# Altium schematic sheet 22_Hub.SchDoc
size A3; SheetNumber: 4; SheetTotal: 10
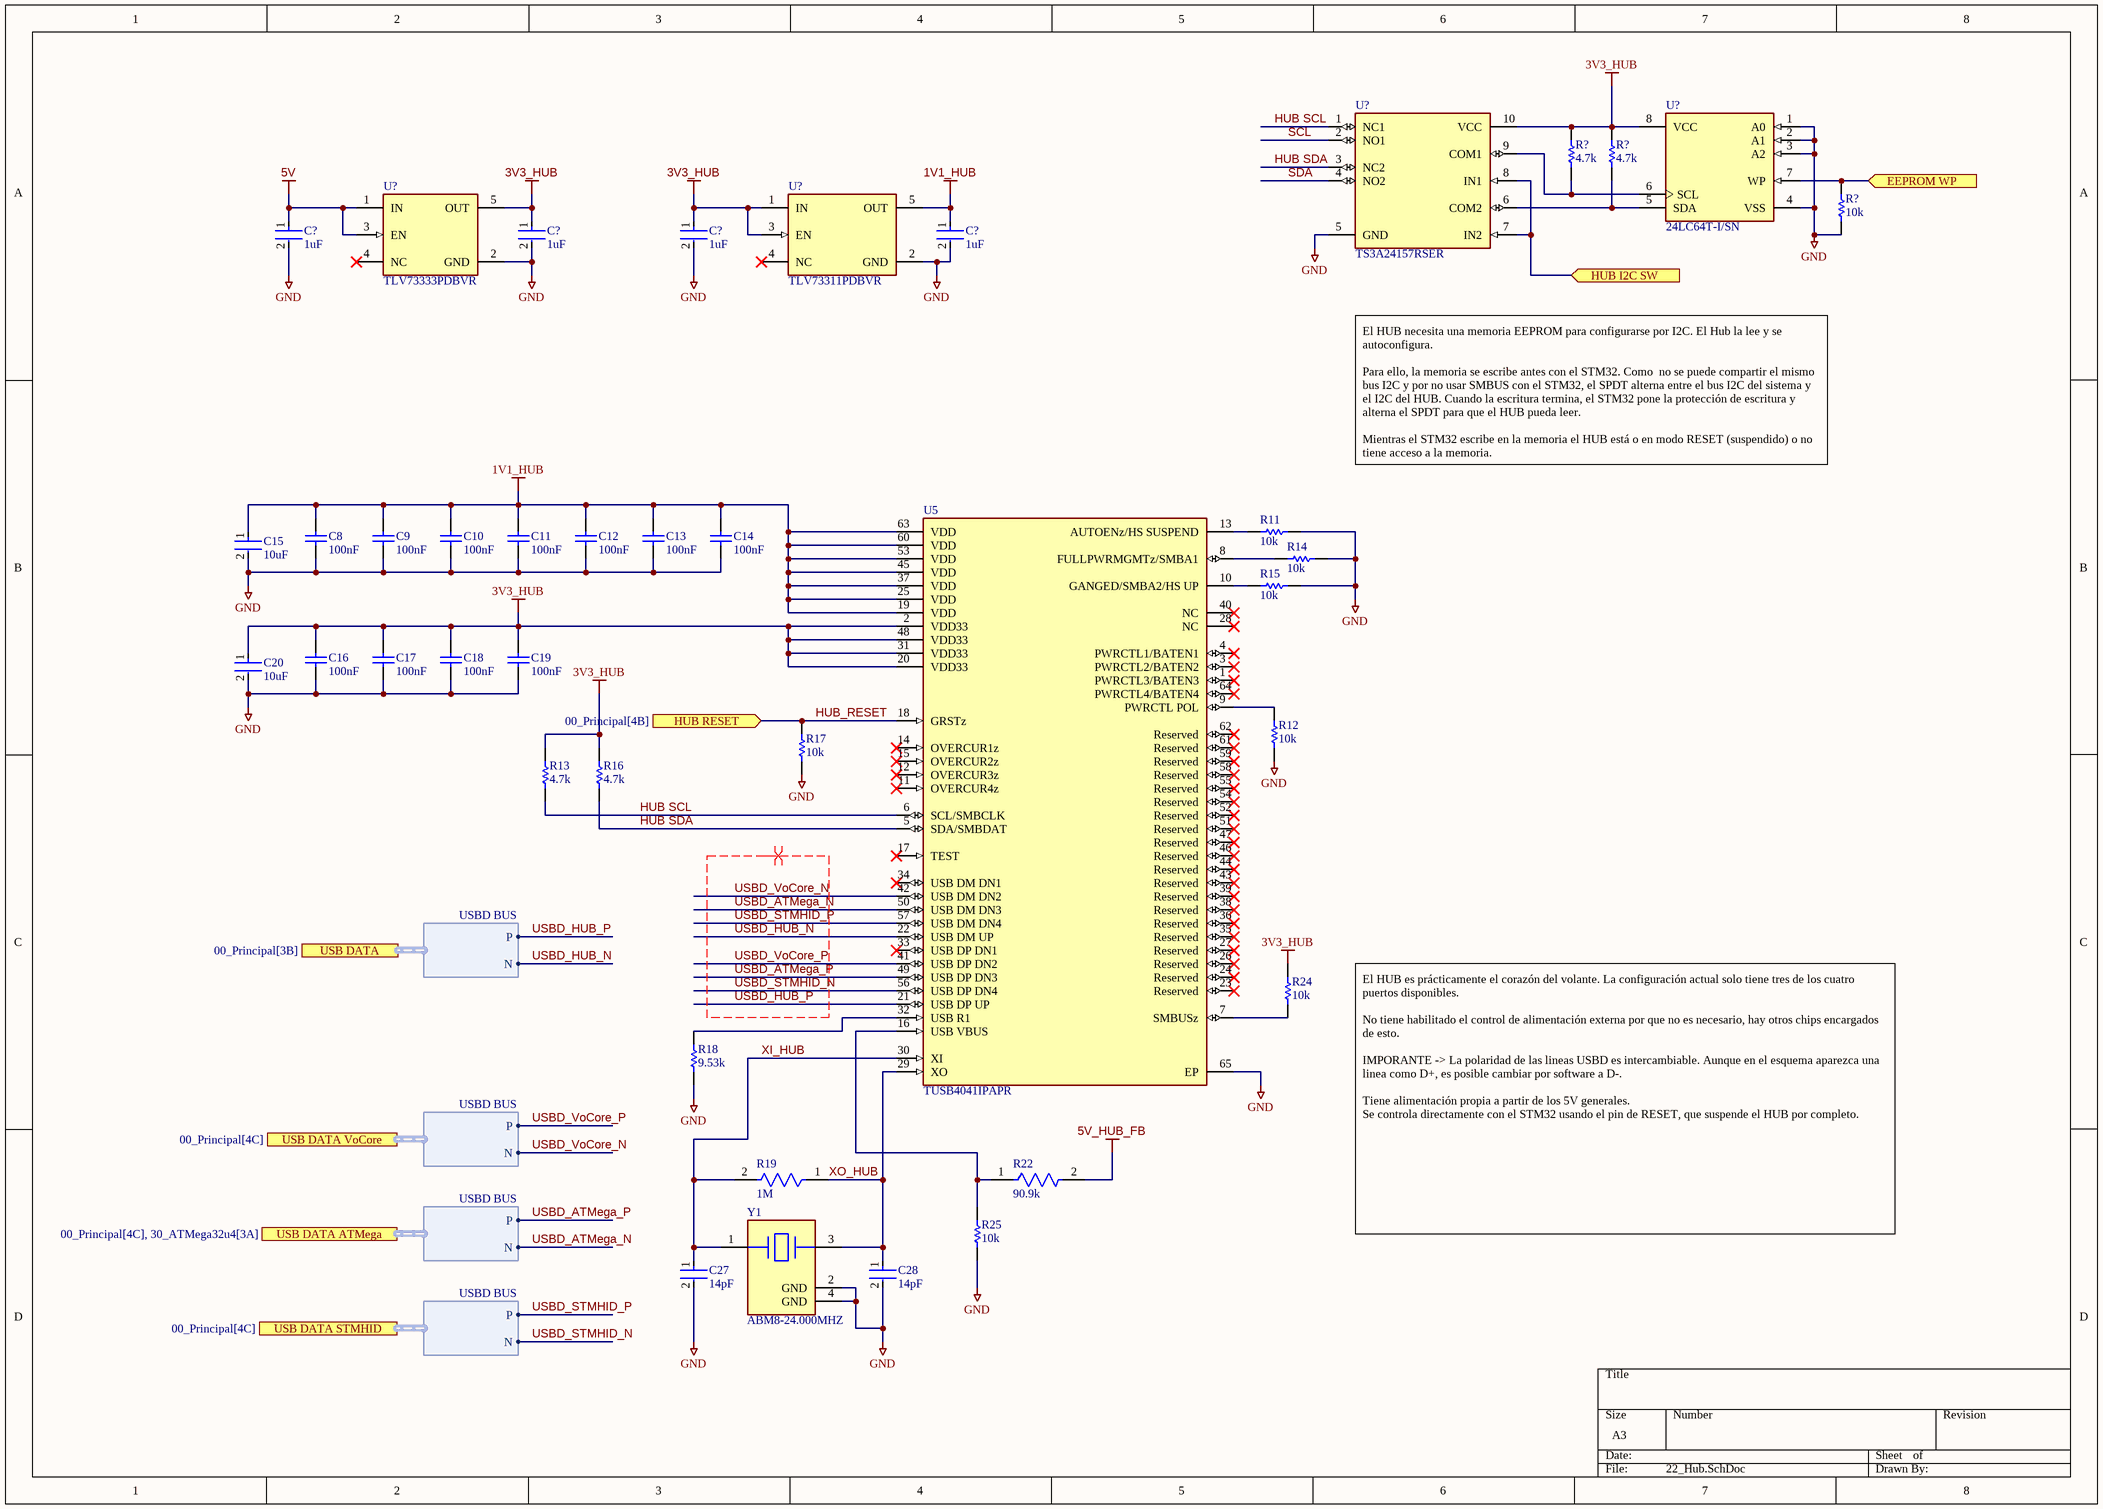
[diagram p0: 22_Hub.SchDoc]

## Parts
(Parts that share a designator on the sheet are numbered #1, #2 ... from top to bottom, then left to right.)
C8  100nF  [CAPC1005X55X25NL05T05]
C9  100nF  [CAPC1005X55X25NL05T05]
C10  100nF  [CAPC1005X55X25NL05T05]
C11  100nF  [CAPC1005X55X25NL05T05]
C12  100nF  [CAPC1005X55X25NL05T05]
C13  100nF  [CAPC1005X55X25NL05T05]
C14  100nF  [CAPC1005X55X25NL05T05]
C15  10uF  [FP-GRM155-0_2-MFG]
C16  100nF  [CAPC1005X55X25NL05T05]
C17  100nF  [CAPC1005X55X25NL05T05]
C18  100nF  [CAPC1005X55X25NL05T05]
C19  100nF  [CAPC1005X55X25NL05T05]
C20  10uF  [FP-GRM155-0_2-MFG]
C27  14pF  [FP-GJM155-0_05-IPC_C]
C28  14pF  [FP-GJM155-0_05-IPC_C]
C?#1  1uF  [FP-C0402C-BB-IPC_B]
C?#2  1uF  [FP-C0402C-BB-IPC_B]
C?#3  1uF  [FP-C0402C-BB-IPC_B]
C?#4  1uF  [FP-C0402C-BB-IPC_B]
R11  10k  [RESC1005X40X25ML05T05]
R12  10k  [RESC1005X40X25NL05T05]
R13  4.7k  [RESC1005X40X25ML05T10]
R14  10k  [RESC1005X40X25ML05T05]
R15  10k  [RESC1005X40X25ML05T05]
R16  4.7k  [RESC1005X40X25ML05T10]
R17  10k  [RESC1005X40X25ML05T05]
R18  9.53k  [RESC1609X50X30NL10T20]
R19  1M  [FP-CRCW0402-C-e3-IPC_B]
R22  90.9k  [FP-RK73H1E-IPC_C]
R24  10k  [RESC1005X40X25NL05T05]
R25  10k  [RESC1005X40X25NL05T05]
R?#1  4.7k  [RESC1005X40X25ML05T10]
R?#2  4.7k  [RESC1005X40X25ML05T10]
R?#3  10k  [RESC1005X40X25ML05T05]
U5  TUSB4041IPAPR  [FP-PAP0064K-MFG]
U?#1  TS3A24157RSER  [FP-RSE0010A-MFG]
U?#2  24LC64T-I/SN  [FP-C04-057-SN-MFG]
U?#3  TLV73333PDBVR  [FP-DBV0005A-MFG]
U?#4  TLV73311PDBVR  [FP-DBV0005A-IPC_C]
Y1  ABM8-24.000MHZ  [FP-ABM8-MFG]

## Ports
EEPROM WP (in), HUB I2C SW (in), HUB RESET (in, see 00_Principal[4B]), USB DATA (harness USBD BUS, see 00_Principal[3B]), USB DATA ATMega (harness USBD BUS, see 00_Principal[4C], 30_ATMega32u4[3A]), USB DATA STMHID (harness USBD BUS, see 00_Principal[4C]), USB DATA VoCore (harness USBD BUS, see 00_Principal[4C])

## Harnesses
USBD BUS: P, N

## Nets
1V1_HUB: C8.2 C9.2 C10.2 C11.2 C12.2 C13.2 C14.2 C15.1 C?#4.1 U5.19(VDD) U5.25(VDD) U5.37(VDD) U5.45(VDD) U5.53(VDD) U5.60(VDD) U5.63(VDD) U?#4.5(OUT)
3V3_HUB: C16.2 C17.2 C18.2 C19.2 C20.1 C?#2.1 C?#3.1 R13.2 R16.2 R24.2 R?#1.2 R?#2.2 U5.2(VDD33) U5.20(VDD33) U5.31(VDD33) U5.48(VDD33) U?#1.10(VCC) U?#2.8(VCC) U?#3.5(OUT) U?#4.1(IN) U?#4.3(EN)
5V: C?#1.1 U?#3.1(IN) U?#3.3(EN)
5V_HUB_FB: R22.2
GND: C8.1 C9.1 C10.1 C11.1 C12.1 C13.1 C14.1 C15.2 C16.1 C17.1 C18.1 C19.1 C20.2 C27.2 C28.2 C?#1.2 C?#2.2 C?#3.2 C?#4.2 R11.1 R12.1 R14.1 R15.1 R17.2 R18.1 R25.1 R?#3.2 U5.65(EP) U?#1.5(GND) U?#2.1(A0) U?#2.2(A1) U?#2.3(A2) U?#2.4(VSS) U?#3.2(GND) U?#4.2(GND) Y1.2(GND) Y1.4(GND)
EEPROM WP: R?#3.1 U?#2.7(WP) ; port EEPROM WP
HUB I2C SW: U?#1.7(IN2) U?#1.8(IN1) ; port HUB I2C SW
HUB SCL: R13.1 U5.6(SCL/SMBCLK) U?#1.1(NC1)
HUB SDA: R16.1 U5.5(SDA/SMBDAT) U?#1.3(NC2)
HUB_RESET: R17.1 U5.18(GRSTz) ; port HUB RESET
SCL: U?#1.2(NO1)
SDA: U?#1.4(NO2)
USBD_ATMega_N: U5.50(USB_DM_DN3) ; port USB DATA ATMega.N
USBD_ATMega_P: U5.49(USB_DP_DN3) ; port USB DATA ATMega.P
USBD_HUB_N: U5.22(USB_DM_UP) ; port USB DATA.N
USBD_HUB_P: U5.21(USB_DP_UP) ; port USB DATA.P
USBD_STMHID_N: U5.56(USB_DP_DN4) ; port USB DATA STMHID.N
USBD_STMHID_P: U5.57(USB_DM_DN4) ; port USB DATA STMHID.P
USBD_VoCore_N: U5.42(USB_DM_DN2) ; port USB DATA VoCore.N
USBD_VoCore_P: U5.41(USB_DP_DN2) ; port USB DATA VoCore.P
XI_HUB: C27.1 R19.2 U5.30(XI) Y1.1
XO_HUB: C28.1 R19.1 U5.29(XO) Y1.3
NetR11_2: R11.2 U5.13(AUTOENz/HS_SUSPEND)
NetR12_2: R12.2 U5.9(PWRCTL_POL)
NetR14_2: R14.2 U5.8(FULLPWRMGMTz/SMBA1)
NetR15_2: R15.2 U5.10(GANGED/SMBA2/HS_UP)
NetR18_2: R18.2 U5.32(USB_R1)
NetR22_1: R22.1 R25.2 U5.16(USB_VBUS)
NetR24_1: R24.1 U5.7(SMBUSz)
NetR?#1_1: R?#1.1 U?#1.9(COM1) U?#2.6(SCL)
NetR?#2_1: R?#2.1 U?#1.6(COM2) U?#2.5(SDA)

Not connected (* = marked no-connect by the designer): U5 1(PWRCTL3/BATEN3)* 3(PWRCTL2/BATEN2)* 4(PWRCTL1/BATEN1)* 11(OVERCUR4z)* 12(OVERCUR3z)* 14(OVERCUR1z)* 15(OVERCUR2z)* 17(TEST)* 23(Reserved)* 24(Reserved)* 26(Reserved)* 27(Reserved)* 28(NC)* 33(USB_DP_DN1)* 34(USB_DM_DN1)* 35(Reserved)* 36(Reserved)* 38(Reserved)* 39(Reserved)* 40(NC)* 43(Reserved)* 44(Reserved)* 46(Reserved)* 47(Reserved)* 51(Reserved)* 52(Reserved)* 54(Reserved)* 55(Reserved)* 58(Reserved)* 59(Reserved)* 61(Reserved)* 62(Reserved)* 64(PWRCTL4/BATEN4)*; U?#3 4(NC)*; U?#4 4(NC)*

## Layout directives
differential pair: USBD_ATMega_N, USBD_ATMega_P, USBD_HUB_N, USBD_HUB_P, USBD_STMHID_N, USBD_STMHID_P, USBD_VoCore_N, USBD_VoCore_P

## Notes on the sheet
- El HUB necesita una memoria EEPROM para configurarse por I2C. El Hub la lee y se autoconfigura.
  Para ello, la memoria se escribe antes con el STM32. Como  no se puede compartir el mismo bus I2C y por no usar SMBUS con el STM32, el SPDT alterna entre el bus I2C del sistema y el I2C del HUB. Cuando la escritura termina, el STM32 pone la protección de escritura y alterna el SPDT para que el HUB pueda leer.
  Mientras el STM32 escribe en la memoria el HUB está o en modo RESET (suspendido) o no tiene acceso a la memoria.
- El HUB es prácticamente el corazón del volante. La configuración actual solo tiene tres de los cuatro puertos disponibles.
  No tiene habilitado el control de alimentación externa por que no es necesario, hay otros chips encargados de esto.
  IMPORANTE -> La polaridad de las lineas USBD es intercambiable. Aunque en el esquema aparezca una linea como D+, es posible cambiar por software a D-.
  Tiene alimentación propia a partir de los 5V generales.
  Se controla directamente con el STM32 usando el pin de RESET, que suspende el HUB por completo.

## Library data of the parts
C8-C14 C16-C19 = CMP-2008-02030-1: Manufacturer: Vitramon; Part Number: VJ0402Y104KXJCW1BC
C15 C20 = CMP-06035-002770-1: Chip Multilayer Ceramic Capacitors for General Purpose, 0402, 10uF, X5R, 15%, 20%, 4V
C27 C28 = CMP-06035-029519-1: Multi-Layer Ceramic Capacitor 14pF C0G  ±1% 0402 Paper T/R
C?#1-C?#4 = CMP-03020-034679-1: CAP CER 1UF 16V X5R 0402; Dielectric Material: Ceramic; Tolerance: 10%; RoHS Compliant: Yes; Voltage Rating (DC): 16V; Voltage Rating: 16V; Max Operating Temperature: 85°C; Packaging: Cut Tape; Width: 0.02inch; Dielectric: X5R; Lead Free: Lead Free; Min Operating Temperature: -55°C; Mount: Surface Mount; Case/Package: 0402; Thickness: 0.022inch; REACH SVHC: No SVHC; Length: 0.039inch; Case Code (Metric): 1005; Case Code (Imperial): 0402; Capacitance: 1uF
R11 R12 R14 R15 R17 R24 R25 R?#3 = CMP-2002-00601-1: Manufacturer: Panasonic; Part Number: ERJ-2RHD1002X
R13 R16 R?#1 R?#2 = CMP-2002-06456-1: Manufacturer: Panasonic; Part Number: ERJ-S02F4701X
R18 = CMP-2000-03655-1: Manufacturer: Vishay Dale; Part Number: CRCW06039K53FKEA
R19 = CMP-02407-013080-1: RES 1M OHM 1% 1/16W 0402; Max Power Dissipation: 63mW; Temperature Coefficient: 100ppm/°C; Power Rating: 62.5mW; Resistance: 1MR; Tolerance: 1%; Contact Plating: Tin; Max Operating Temperature: 155°C; Number of Terminations: 2; Min Operating Temperature: -55°C; Lead Free: Lead Free; Length: 1mm; RoHS Compliant: Yes; Series: CRCW-C; Case/Package: 0402; Packaging: Tape and Reel; Mount: Surface Mount; Resistor Type: Thick Film; Termination: Wraparound
R22 = CMP-04015-083698-1: 90.9kΩ ±1% 0.1W Chip Resistor 0402 Flat Chip (Anti-Sulfuration) AEC-Q200 Qualified; Voltage Rating: 50V; Resistance: 90.9kR; Power Rating: 63mW; Temperature Coefficient: 100ppm/°C; Case Code (Metric): 1005; Tolerance: 1%; Case/Package: 0402; Width: 0.5mm; Case Code (Imperial): 0402; Height: 0.35mm; Weight: 2.3E-05oz; Min Operating Temperature: -55°C; Length: 1mm; RoHS Compliant: Yes; Termination: SMD/SMT; Max Operating Temperature: 155°C; Packaging: Tape and Reel; Package Quantity: 10000
U5 = CMP-04877-000003-1: IC USB 2.0 4PORT HUB 64HTQFP; Manufacturer: Texas Instruments; Interface: I2C,USB,SMBus; Max Supply Voltage: 3.6V; Nominal Supply Current: 15uA; Standoff Height: 0.05mm; Min Supply Voltage: 0.99V; Usb Standard: USB 2.0; Number Of Ports: 4; Max Junction Temp: +105°C; Data Rate: 480Mbits/s; Temperature: -40°C to +85°C; ComponentLink2Description: Datasheet; Category: IC; Device Class L3: USB Interface ICs; Device Class L2: Interface ICs; Height: 1.2mm; ComponentLink2URL: http://www.ti.com/lit/ds/symlink/tusb4041i.pdf; Ipc Land Pattern Name: QFP50P1200X1200X120-64; Temperature Range High: +85°C; Lead Free: Yes; Manufacturer Part Number: TUSB4041IPAPR; Temperature Range Low: -40°C; RoHS: TRUE; Digikey Description: IC USB 2.0 4PORT HUB 64HTQFP; Device Class L1: Integrated Circuits (ICs); Ambient Temperature Range Low: -40°C; Automotive: No; Package: PAP0064K; Octopart: https://octopart.com/tusb4041ipapr-texas+instruments-61734371; Ambient Temperature Range High: +85°C
U?#1 = CMP-04892-000112-1: IC SWITCH DUAL SPDT 10UQFN; Polarity: Non-Inverting; Max Supply Current: 25nA; Operating Supply Voltage: 3V; Number of Outputs: 4; Number of Inputs: 2; Supply Type: Single; Bandwidth: 50MHz; Turn-On Delay Time: 35ns; Low Level Output Current: 300mA; Operating Supply Current: 15nA; On-State Resistance: 600mR; Min Supply Voltage: 1.65V; Turn-Off Delay Time: 25ns; Max Supply Voltage: 3.6V; RoHS Compliant: Yes; Max Operating Temperature: 85°C; Series: -; Radiation Hardening: No; Width: 1.55mm; Number of Pins: 10; REACH SVHC: No SVHC; Contact Plating: Gold; Length: 2.05mm; Number of Channels: 2; Min Operating Temperature: -40°C; Lead Free: Lead Free; Mount: Surface Mount; Packaging: Tape and Reel; Weight: 0.000247oz; Package Quantity: 1; Case/Package: QFN; High Level Output Current: 300mA; Height: 0.55mm; Throw Configuration: SPDT
U?#2 = CMP-0159-00199-2: IC EEPROM 64K I2C 400KHZ 8SOIC; Manufacturer: Microchip Technology; Min Supply Voltage: 2.5V; Description: Microchip 24LC64T-I/SN Serial EEPROM Memory, 64kbit, 900ns, 2.5 5.5 V 8-Pin SOIC; Interface: I2C,2-Wire; Access Time: 900ns; Memory Size: 64Kbits; Max Supply Voltage: 5.5V; Nominal Supply Current: 0.05-100uA; Standoff Height: 0.1mm; Temperature: -40°C to +85°C; Automotive: No; Ambient Temperature Range Low: -40°C; Device Class L1: Integrated Circuits (ICs); Footprint 1 Description: SOIC, 8-Leads, Body 4.9x3.8mm, Pitch 1.27mm, IPC High Density; Octopart: https://octopart.com/24lc64t-i%2Fsn-microchip-451854; Footprint Url: http://ww1.microchip.com/downloads/en/DeviceDoc/08L_SOIC_150_3dot9mm_SN_C04-00057e.pdf; Footprint 0 Description: SOIC, 8-Leads, Body 4.9x3.8mm, Pitch 1.27mm, IPC Medium Density; Memory Type: EEPROM; ComponentLink2Description: Datasheet; Digikey Description: IC EEPROM 64K I2C 400KHZ 8SOIC; Manufacturer Part Number: 24LC64T-I/SN; Temperature Range Low: -40°C; Footprint 2 Description: SOIC, 8-Leads, Body 4.9x3.8mm, Pitch 1.27mm, IPC Low Density; ComponentLink2URL: http://ww1.microchip.com/downloads/en/DeviceDoc/21189T.pdf; RoHS: TRUE; Device Class L2: Memory; Ambient Temperature Range High: +85°C; Mouser Description: EEPROM 8kx8 - 2.5V; Lead Free: Yes; Temperature Range High: +85°C; Frequency: 400kHz; Height: 1.75mm; Package: C04-057-SN; Ipc Land Pattern Name: SOIC127P600X175-8; Category: IC; Device Class L3: EEPROM
U?#3 = CMP-04917-000053-1: IC REG LINEAR 3.3V 300MA SOT23-5; Manufacturer: Texas Instruments; Max Junction Temp: +125°C; Accuracy Percentage: 1%; Min Supply Voltage: 1.4V; Number Of Outputs: 1; Dropout Voltage: 125mV; Nominal Supply Current: 34uA; Max Supply Voltage: 5.5V; Output Type: Fixed; Standoff Height: 0mm; Digikey Description: IC REG LINEAR 3.3V 300MA SOT23-5; Manufacturer Part Number: TLV73333PDBVR; Temperature Range High: +125°C; Temperature: -40°C to +125°C; Output Current: 300mA; Mouser Description: LDO Voltage Regulators Capacitr-Free 300-mA 5-SOT-23 -40 to 125; Automotive: No; Height: 1.45mm; Device Class L3: Voltage Regulators - Linear; ComponentLink2Description: Datasheet; Device Class L1: Integrated Circuits (ICs); ComponentLink2URL: http://www.ti.com/lit/ds/symlink/tlv733p.pdf; Octopart: https://octopart.com/tlv73333pdbvr-texas+instruments-51080890; Temperature Range Low: -40°C; RoHS: TRUE; Lead Free: Yes; Output Voltage: 3.3V; Package: DBV0005A; Device Class L2: Power Management ICs; Category: IC
U?#4 = CMP-04917-000331-1: IC REG LINEAR 1.1V 300MA SOT23-5; Number of Regulators: 1; Quiescent Current: 34uA; Max Input Voltage: 5.5V; Min Input Voltage: 1.4V; Polarity: Positive; Power Supply Rejection Ratio (PSRR): 28dB; Output Type: Fixed; Accuracy: 1%; Dropout Voltage: 122mV; Min Current Limit: 360mA; Mount: Surface Mount; Number of Pins: 5; Case/Package: SOT-23-5; Max Output Current: 300mA; Min Operating Temperature: -40°C; Lead Free: Lead Free; Output Current: 300mA; Output Voltage: 1.1V; RoHS Compliant: Yes; Package Quantity: 3000; Number of Outputs: 1; Packaging: Tape and Reel; Contact Plating: Gold; Weight: 0.000557oz; Max Operating Temperature: 125°C
Y1 = CMP-27762-000457-1: Crystal 24MHz ±10ppm 12pF SMD-4 3.2mm x 2.5mm